# Altium schematic sheet USB.SchDoc
size A; SheetNumber: 2; SheetTotal: 2
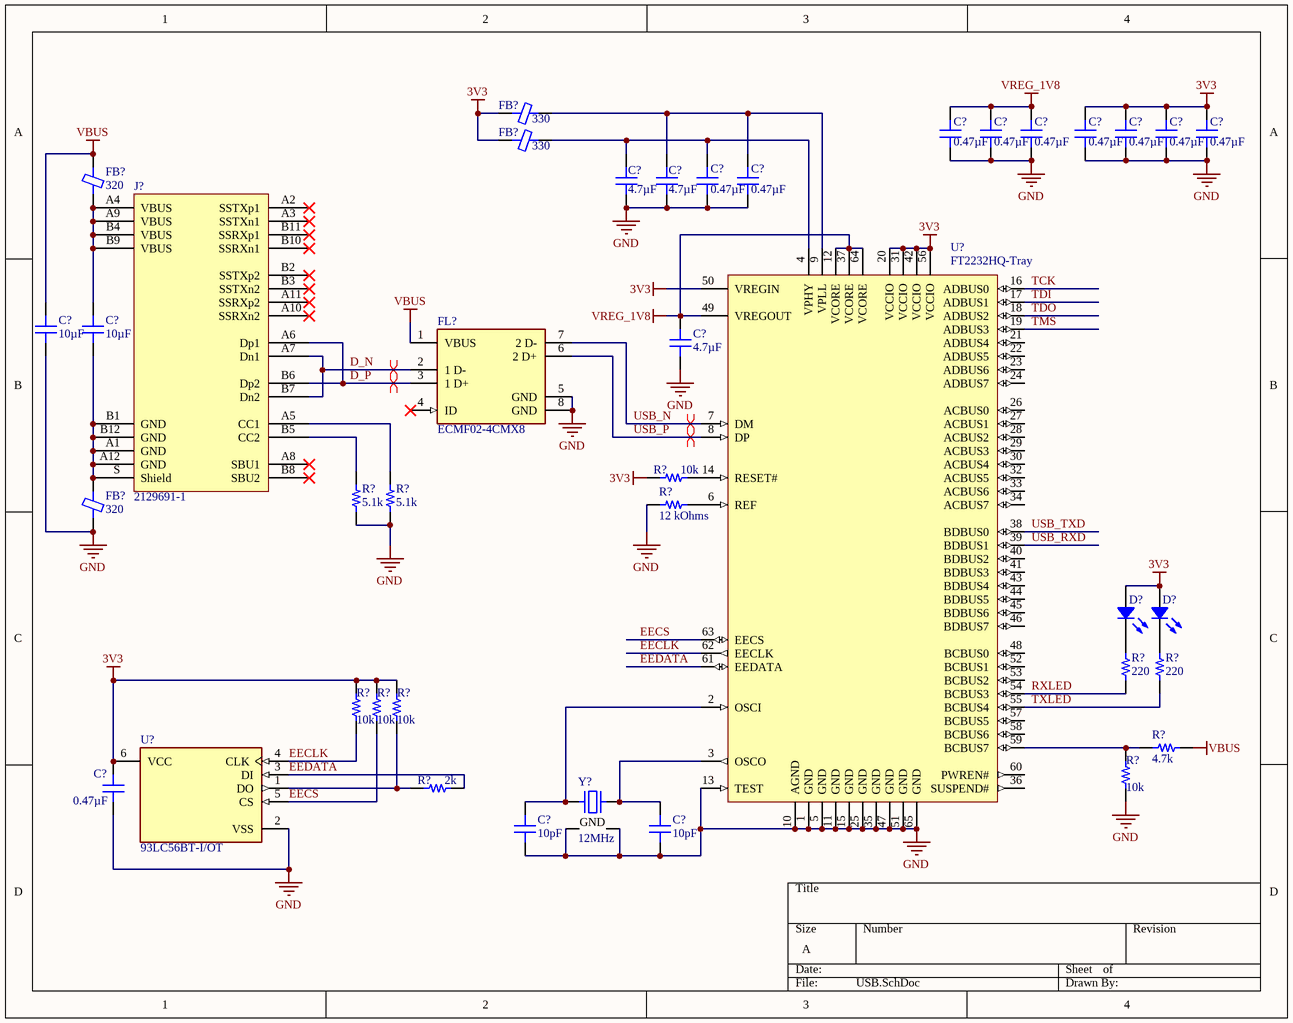
[diagram p0: USB.SchDoc]

## Parts
(Parts that share a designator on the sheet are numbered #1, #2 ... from top to bottom, then left to right.)
C?#1  0.47µF  [CAP 0603_1608]
C?#2  0.47µF  [CAP 0603_1608]
C?#3  0.47µF  [CAP 0603_1608]
C?#4  0.47µF  [CAP 0603_1608]
C?#5  0.47µF  [CAP 0603_1608]
C?#6  0.47µF  [CAP 0603_1608]
C?#7  0.47µF  [CAP 0603_1608]
C?#8  4.7µF  [CAP 0603_1608]
C?#9  4.7µF  [CAP 0603_1608]
C?#10  0.47µF  [CAP 0603_1608]
C?#11  0.47µF  [CAP 0603_1608]
C?#12  10µF  [CAP 0805_2012]
C?#13  10µF  [CAP 0805_2012]
C?#14  4.7µF  [CAP 0603_1608]
C?#15  0.47µF  [CAP 0603_1608]
C?#16  10pF  [CAP 0603_1608]
C?#17  10pF  [CAP 0603_1608]
D?#1  Yellow  [LED 0805_2012 YELLOW]  (value not drawn)
D?#2  Yellow  [LED 0805_2012 YELLOW]  (value not drawn)
FB?#1  330  [FER 0603_1608]
FB?#2  330  [FER 0603_1608]
FB?#3  320  [FER 0805_2012]
FB?#4  320  [FER 0805_2012]
FL?  ECMF02-4CMX8  [FP-Micro_QFN-8L-MFG]
J?  2129691-1  [TE USB-C 2129691-1]
R?#1  10k  [RES 0603_1608]
R?#2  5.1k  [RES 0603_1608]
R?#3  5.1k  [RES 0603_1608]
R?#4  12 kOhms  [RES 0603_1608]
R?#5  220  [RES 0603_1608]
R?#6  220  [RES 0603_1608]
R?#7  10k  [RES 0603_1608]
R?#8  10k  [RES 0603_1608]
R?#9  10k  [RES 0603_1608]
R?#10  4.7k  [RES 0603_1608]
R?#11  10k  [RES 0603_1608]
R?#12  2k  [RES 0603_1608]
U?#1  FT2232HQ-Tray  [QFN64_2_N]
U?#2  93LC56BT-I/OT  [FP-C04-028-MFG]
Y?  12MHz  [NDK NX3225SA]

## Nets
3V3: C?#4.2 C?#5.2 C?#6.2 C?#7.2 C?#15.1 D?#1.1 D?#2.1 FB?#1.1 FB?#2.1 R?#1.1 R?#7.2 R?#8.2 R?#9.2 U?#1.20(VCCIO) U?#1.31(VCCIO) U?#1.42(VCCIO) U?#1.50(VREGIN) U?#1.56(VCCIO) U?#2.6(VCC)
GND: C?#1.1 C?#2.1 C?#3.1 C?#4.1 C?#5.1 C?#6.1 C?#7.1 C?#8.1 C?#9.1 C?#10.1 C?#11.1 C?#12.1 C?#14.1 C?#15.2 C?#16.2 C?#17.2 FB?#4.1 FL?.5(GND) FL?.8(GND) R?#2.2 R?#3.2 R?#4.1 R?#11.1 U?#1.1(GND) U?#1.5(GND) U?#1.10(AGND) U?#1.11(GND) U?#1.13(TEST) U?#1.15(GND) U?#1.25(GND) U?#1.35(GND) U?#1.47(GND) U?#1.51(GND) U?#1.65(GND) U?#2.2(VSS) Y?.2(GND) Y?.4(GND)
VBUS: C?#12.2 FB?#3.2 FL?.1(VBUS) R?#10.2
VREG_1V8: C?#1.2 C?#2.2 C?#3.2 C?#14.2 U?#1.12(VCORE) U?#1.37(VCORE) U?#1.49(VREGOUT) U?#1.64(VCORE)
D_N: FL?.2(1_D-) J?.A7(Dn1) J?.B7(Dn2)
D_P: FL?.3(1_D+) J?.A6(Dp1) J?.B6(Dp2)
EECLK: R?#7.1 U?#1.62(EECLK) U?#2.4(CLK)
EECS: R?#8.1 U?#1.63(EECS) U?#2.5(CS)
EEDATA: R?#12.2 U?#1.61(EEDATA) U?#2.3(DI)
RXLED: R?#5.1 U?#1.54(BCBUS3)
TCK: U?#1.16(ADBUS0)
TDI: U?#1.17(ADBUS1)
TDO: U?#1.18(ADBUS2)
TMS: U?#1.19(ADBUS3)
TXLED: R?#6.1 U?#1.55(BCBUS4)
USB_N: FL?.7(2_D-) U?#1.7(DM)
USB_P: FL?.6(2_D+) U?#1.8(DP)
USB_RXD: U?#1.39(BDBUS1)
USB_TXD: U?#1.38(BDBUS0)
NetC?#8_2: C?#8.2 C?#10.2 FB?#2.2 U?#1.4(VPHY)
NetC?#9_2: C?#9.2 C?#11.2 FB?#1.2 U?#1.9(VPLL)
NetC?#13_1: C?#13.1 FB?#4.2 J?.A1(GND) J?.A12(GND) J?.B1(GND) J?.B12(GND) J?.S(Shield)
NetC?#13_2: C?#13.2 FB?#3.1 J?.A4(VBUS) J?.A9(VBUS) J?.B4(VBUS) J?.B9(VBUS)
NetC?#16_1: C?#16.1 U?#1.2(OSCI) Y?.1
NetC?#17_1: C?#17.1 U?#1.3(OSCO) Y?.3
NetD?#1_2: D?#1.2 R?#5.2
NetD?#2_2: D?#2.2 R?#6.2
NetJ?_A5: J?.A5(CC1) R?#3.1
NetJ?_B5: J?.B5(CC2) R?#2.1
NetR?#1_2: R?#1.2 U?#1.14(RESET#)
NetR?#4_2: R?#4.2 U?#1.6(REF)
NetR?#9_1: R?#9.1 R?#12.1 U?#2.1(DO)
NetR?#10_1: R?#10.1 R?#11.2 U?#1.59(BCBUS7)

Not connected (* = marked no-connect by the designer): FL? 4(ID)*; J? A2(SSTXp1)* A3(SSTXn1)* A8(SBU1)* A10(SSRXn2)* A11(SSRXp2)* B2(SSTXp2)* B3(SSTXn2)* B8(SBU2)* B10(SSRXn1)* B11(SSRXp1)*; U?#1 21(ADBUS4) 22(ADBUS5) 23(ADBUS6) 24(ADBUS7) 26(ACBUS0) 27(ACBUS1) 28(ACBUS2) 29(ACBUS3) 30(ACBUS4) 32(ACBUS5) 33(ACBUS6) 34(ACBUS7) 36(SUSPEND#) 40(BDBUS2) 41(BDBUS3) 43(BDBUS4) 44(BDBUS5) 45(BDBUS6) 46(BDBUS7) 48(BCBUS0) 52(BCBUS1) 53(BCBUS2) 57(BCBUS5) 58(BCBUS6) 60(PWREN#)

## Layout directives
differential pair: D_N, D_P, USB_N, USB_P

## Library data of the parts
C?#1-C?#7 C?#10 C?#11 C?#15 = GCM188R71C474KA55D: CAP CER 0.47UF 16V X7R 0603; Manufacturer: Murata Electronics; Tolerance: ±10%; Part Number: GCM188R71C474KA55D; Value: 0.47µF; Applications: Automotive; Capacitance: 0.47µF; ComponentLink1Description: Datasheet; ComponentLink1URL: https://www.murata.com/~/media/webrenewal/support/library/catalog/products/capacitor/mlcc/c03e.ashx?la=en-us; ComponentLink2Description: DigiKey Link; ComponentLink2URL: http://digikey.com/product-detail/en/murata-electronics/GCM188R71C474KA55D/490-4775-1-ND/1641694; Device Package: 0603 (1608 Metric); LastUpdated: 9/2/2020 1:03:20 AM; Lifecycle Status: Active; Minimum Order: 1; Mounting Type: Surface Mount, MLCC; Operating Temperature: -55°C ~ 125°C; Package / Case: 0603 (1608 Metric); Packaging: TapeAndReel; PartId: 11207; Part Status: Active; Price: 0.04; Ratings: AEC-Q200; Series: GCM; Size / Dimension: 0.063" L x 0.031" W (1.60mm x 0.80mm); Supplier 1: DigiKey; Supplier Part Number 1: 490-4775-1-ND; Temperature Coefficient: X7R; Thickness (Max): 0.035" (0.90mm); Voltage - Rated: 16V
C?#8 C?#9 C?#14 = C1608X7S0J475K080AC: CAP CER 4.7UF 6.3V X7S 0603; Manufacturer: TDK Corporation; Tolerance: ±10%; Part Number: C1608X7S0J475K080AC; Value: 4.7µF; Applications: General Purpose; Capacitance: 4.7µF; ComponentLink1Description: Datasheet; ComponentLink1URL: https://product.tdk.com/info/en/catalog/datasheets/mlcc_commercial_general_en.pdf?ref_disty=digikey; ComponentLink2Description: DigiKey Link; ComponentLink2URL: http://digikey.com/product-detail/en/tdk-corporation/C1608X7S0J475K080AC/445-9120-1-ND/3661604; Device Package: 0603 (1608 Metric); Features: Low ESL; LastUpdated: 9/2/2020 1:03:32 AM; Lifecycle Status: Active; Minimum Order: 1; Mounting Type: Surface Mount, MLCC; Operating Temperature: -55°C ~ 125°C; Package / Case: 0603 (1608 Metric); Packaging: TapeAndReel; PartId: 4119; Part Status: Active; Price: 0.07; Series: C; Size / Dimension: 0.063" L x 0.031" W (1.60mm x 0.80mm); Supplier 1: DigiKey; Supplier Part Number 1: 445-9120-1-ND; Temperature Coefficient: X7S; Thickness (Max): 0.035" (0.90mm); Voltage - Rated: 6.3V
C?#12 C?#13 = C2012X5R1E106K125AB: CAP CER 10UF 25V X5R 0805; Manufacturer: TDK Corporation; Tolerance: ±10%; Part Number: C2012X5R1E106K125AB; Value: 10µF; Applications: General Purpose; Capacitance: 10µF; ComponentLink1Description: Datasheet; ComponentLink1URL: https://product.tdk.com/info/en/catalog/datasheets/mlcc_commercial_general_en.pdf?ref_disty=digikey; ComponentLink2Description: DigiKey Link; ComponentLink2URL: http://digikey.com/product-detail/en/tdk-corporation/C2012X5R1E106K125AB/445-5984-1-ND/2444025; Device Package: 0805 (2012 Metric); Features: Low ESL; LastUpdated: 9/2/2020 1:04:38 AM; Lifecycle Status: Active; Minimum Order: 1; Mounting Type: Surface Mount, MLCC; Operating Temperature: -55°C ~ 85°C; Package / Case: 0805 (2012 Metric); Packaging: TapeAndReel; PartId: 4850; Part Status: Active; Price: 0.08; Series: C; Size / Dimension: 0.079" L x 0.049" W (2.00mm x 1.25mm); Supplier 1: DigiKey; Supplier Part Number 1: 445-5984-1-ND; Temperature Coefficient: X5R; Thickness (Max): 0.057" (1.45mm); Voltage - Rated: 25V
C?#16 C?#17 = 06031A100CAT2A: CAP CER 10PF 100V C0G/NP0 0603; Manufacturer: AVX Corporation; Temperature Coefficient: C0G, NP0; Tolerance: ±0.25pF; Part Number: 06031A100CAT2A; Value: 10pF; Applications: General Purpose; Capacitance: 10pF; ComponentLink1Description: Datasheet; ComponentLink1URL: http://datasheets.avx.com/C0GNP0-Dielectric.pdf; ComponentLink2Description: DigiKey Link; ComponentLink2URL: http://digikey.com/product-detail/en/avx-corporation/06031A100CAT2A/478-3668-1-ND/1116366; Device Package: 0603 (1608 Metric); LastUpdated: 9/2/2020 1:03:34 AM; Lifecycle Status: Active; Minimum Order: 1; Mounting Type: Surface Mount, MLCC; Operating Temperature: -55°C ~ 125°C; Package / Case: 0603 (1608 Metric); Packaging: TapeAndReel; PartId: 3258; Part Status: Active; Price: 0.06; Series: -; Size / Dimension: 0.063" L x 0.032" W (1.60mm x 0.81mm); Supplier 1: DigiKey; Supplier Part Number 1: 478-3668-1-ND; Thickness (Max): 0.035" (0.90mm); Voltage - Rated: 100V
D?#1 D?#2 = 5988140107F: LED YELLOW CLEAR 0805 SMD; Manufacturer: Dialight; Configuration: Standard; Current - Test: 20mA; Lens Color: Colorless; Lens Size: 1.40mm x 1.25mm; Lens Style: Rectangle with Flat Top; Millicandela Rating: 130mcd; Viewing Angle: 140°; Voltage - Forward (Vf) (Typ): 2V; Wavelength - Dominant: 593nm; Part Number: 5988140107F; Color: Yellow; ComponentLink1Description: Datasheet; ComponentLink1URL: //media.digikey.com/pdf/Data%20Sheets/Dialight%20PDFs/598_Series_0805_Pkg.pdf; ComponentLink2Description: DigiKey Link; ComponentLink2URL: http://digikey.com/product-detail/en/dialight/5988140107F/350-2041-1-ND/1291345; Device Package: 0805 (2012 Metric); Height (Max): 0.80mm; LastUpdated: 9/2/2020 1:21:22 AM; Lens Transparency: Clear; Lifecycle Status: Active; Minimum Order: 1; Mounting Type: Surface Mount; Package / Case: 0805 (2012 Metric); Packaging: TapeAndReel; PartId: 48; Part Status: Active; Price: 0.07; Series: 598; Size / Dimension: 2.00mm L x 1.25mm W; Supplier 1: DigiKey; Supplier Part Number 1: 350-2041-1-ND; Supplier Device Package: 0805; Value: Yellow
FB?#1 FB?#2 = FBMH1608HM331-TV: FERRITE BEAD 330 OHM 0603 1LN; Manufacturer: Taiyo Yuden; Current Rating (Max): 1.2A; DC Resistance (DCR) (Max): 130mOhm; Filter Type: Power Line; Impedance @ Frequency: 330 Ohms @ 100MHz; Number of Lines: 1; Part Number: FBMH1608HM331-TV; ComponentLink1Description: Datasheet; ComponentLink1URL: https://ds.yuden.co.jp/TYCOMPAS/ut/detail?pn=FBMH1608HM331-TV  &u=M; ComponentLink2Description: DigiKey Link; ComponentLink2URL: http://digikey.com/product-detail/en/taiyo-yuden/FBMH1608HM331-TV/587-3823-1-ND/4875583; Device Package: 0603 (1608 Metric); Height (Max): 0.035" (0.90mm); LastUpdated: 9/2/2020 1:18:18 AM; Lifecycle Status: Active; Minimum Order: 1; Mounting Type: Surface Mount; Operating Temperature: -40°C ~ 125°C; Package / Case: 0603 (1608 Metric); Packaging: TapeAndReel; PartId: 729; Part Status: Active; Price: 0.05; Ratings: AEC-Q200; Series: FB; Size / Dimension: 0.063" L x 0.032" W (1.60mm x 0.80mm); Supplier 1: DigiKey; Supplier Part Number 1: 587-3823-1-ND; Value: 330
FB?#3 FB?#4 = 74279220321: FERRITE BEAD 320 OHM 0805 1LN; Manufacturer: Würth Elektronik; Current Rating (Max): 2.5A; DC Resistance (DCR) (Max): 50mOhm; Impedance @ Frequency: 320 Ohms @ 100MHz; Number of Lines: 1; Part Number: 74279220321; ComponentLink1Description: Datasheet; ComponentLink1URL: https://katalog.we-online.de/pbs/datasheet/74279220321.pdf; ComponentLink2Description: DigiKey Link; ComponentLink2URL: http://digikey.com/product-detail/en/w-rth-elektronik/74279220321/732-6125-1-ND/5050861; Device Package: 0805 (2012 Metric); Height (Max): 0.043" (1.10mm); LastUpdated: 9/2/2020 1:18:21 AM; Lifecycle Status: Active; Minimum Order: 1; Mounting Type: Surface Mount; Operating Temperature: -55°C ~ 125°C; Package / Case: 0805 (2012 Metric); Packaging: TapeAndReel; PartId: 1527; Part Status: Active; Price: 0.20; Series: WE-MPSB; Size / Dimension: 0.079" L x 0.047" W (2.00mm x 1.20mm); Supplier 1: DigiKey; Supplier Part Number 1: 732-6125-1-ND; Value: 320
FL? = CMP-12075-000002-1: COMMON MODE CHOKE 2LN SMD ESD; Number of Lines: 2; DC Resistance (DCR): 4R; Package Quantity: 3000; Case/Package: QFN; Width: 0.047inch; Mount: Surface Mount; Termination: Flat; Length: 0.098inch; Height: 0.022inch; Lead Free: Lead Free; Depth: 1.25mm; REACH SVHC: No SVHC; Max Operating Temperature: 85°C; Min Operating Temperature: -30°C; Number of Pins: 8; Packaging: Tape and Reel
J? = 2129691-1: CONN RCPT USB3.1 TYPEC 24POS SMD; Manufacturer: TE Connectivity AMP Connectors; Connector Type: USB - C (Type - C); Current Rating (Amps): 0.25A, 1.25A, 5A; Gender: Receptacle; Mating Cycles: 10000; Number of Contacts: 24; Number of Ports: 1; Specifications: USB 3.1 (USB 3.1 Gen 2, Superspeed+); Voltage - Rated: 30V; Part Number: 2129691-1; ComponentLink1Description: Datasheet; ComponentLink1URL: //media.digikey.com/pdf/Data%20Sheets/Tyco%20Electonics%20AMP%20PDFs/2129691_Dwg.pdf; ComponentLink2Description: DigiKey Link; ComponentLink2URL: //digikey.com/product-detail/en/te-connectivity-amp-connectors/2129691-1/A122008TR-ND/5401336; LastUpdated: 12/9/2019 8:50:18 PM; Lifecycle Status: 0; Minimum Order: 1; Mounting Feature: Horizontal, Mid Mount; Mounting Type: Board Edge, Cutout; Surface Mount; Through Hole, Right Angle; Operating Temperature: -30°C ~ 85°C; Packaging: TapeAndReel; Part Status: Active; Price: 1.67; Series: -; Supplier 1: DigiKey; Supplier Part Number 1: A122008TR-ND; Termination: Solder
R?#1 R?#7-R?#9 R?#11 = CRCW060310K0FKTA: RES SMD 10K OHM 1% 1/10W 0603; Manufacturer: Vishay Dale; Power (Watts): 0.1W, 1/10W; Resistance: 10 kOhms; Temperature Coefficient: ±100ppm/°C; Part Number: CRCW060310K0FKTA; Value: 10k; ComponentLink1Description: Datasheet; ComponentLink1URL: http://www.vishay.com/docs/20008/dcrcw.pdf; ComponentLink2Description: DigiKey Link; ComponentLink2URL: http://digikey.com/product-detail/en/vishay-dale/CRCW060310K0FKTA/541-2980-1-ND/6073623; Composition: Thick Film; Device Package: 0603 (1608 Metric); Features: Automotive AEC-Q200; Height - Seated (Max): 0.020" (0.50mm); LastUpdated: 9/2/2020 1:10:15 AM; Lifecycle Status: Active; Minimum Order: 1; Number of Terminations: 2; Operating Temperature: -55°C ~ 155°C; Package / Case: 0603 (1608 Metric); Packaging: TapeAndReel; PartId: 9687; Part Status: Active; Price: 0.01; Ratings: AEC-Q200; Series: CRCW; Size / Dimension: 0.063" L x 0.033" W (1.60mm x 0.85mm); Supplier 1: DigiKey; Supplier Part Number 1: 541-2980-1-ND; Supplier Device Package: 0603; Tolerance: ±1%
R?#2 R?#3 = RMCF0603FT5K10: RES 5.1K OHM 1% 1/10W 0603; Manufacturer: Stackpole Electronics Inc; Power (Watts): 0.1W, 1/10W; Resistance: 5.1 kOhms; Temperature Coefficient: ±100ppm/°C; Part Number: RMCF0603FT5K10; Value: 5.1k; ComponentLink1Description: Datasheet; ComponentLink1URL: https://www.seielect.com/catalog/sei-rmcf_rmcp.pdf; ComponentLink2Description: DigiKey Link; ComponentLink2URL: http://digikey.com/product-detail/en/stackpole-electronics-inc/RMCF0603FT5K10/RMCF0603FT5K10CT-ND/1943037; Composition: Thick Film; Device Package: 0603 (1608 Metric); Features: Automotive AEC-Q200; Height - Seated (Max): 0.022" (0.55mm); LastUpdated: 9/2/2020 1:10:13 AM; Lifecycle Status: Active; Minimum Order: 1; Number of Terminations: 2; Operating Temperature: -55°C ~ 155°C; Package / Case: 0603 (1608 Metric); Packaging: CutTape; PartId: 10617; Part Status: Active; Price: 0.10; Ratings: AEC-Q200; Series: RMCF; Size / Dimension: 0.061" L x 0.031" W (1.55mm x 0.80mm); Supplier 1: DigiKey; Supplier Part Number 1: RMCF0603FT5K10CT-ND; Supplier Device Package: 0603; Tolerance: ±1%
R?#4 = CRCW060312K0FKEAHP: RES SMD 12K OHM 1% 1/4W 0603; Manufacturer: Vishay Dale; Power (Watts): 0.25W, 1/4W; Temperature Coefficient: ±100ppm/°C; Part Number: CRCW060312K0FKEAHP; Value: 12 kOhms; ComponentLink1Description: Datasheet; ComponentLink1URL: http://www.vishay.com/docs/20043/crcwhpe3.pdf; ComponentLink2Description: DigiKey Link; ComponentLink2URL: http://digikey.com/product-detail/en/vishay-dale/CRCW060312K0FKEAHP/541-12.0KSCT-ND/5326820; Composition: Thick Film; Device Package: 0603 (1608 Metric); Features: Automotive AEC-Q200, Pulse Withstanding; Height - Seated (Max): 0.022" (0.55mm); LastUpdated: 9/2/2020 1:10:12 AM; Lifecycle Status: Active; Minimum Order: 1; Number of Terminations: 2; Operating Temperature: -55°C ~ 155°C; Package / Case: 0603 (1608 Metric); Packaging: TapeAndReel; PartId: 11340; Part Status: Active; Price: 0.02; Ratings: AEC-Q200; Resistance: 12 kOhms; Series: CRCW-HP; Size / Dimension: 0.063" L x 0.033" W (1.60mm x 0.85mm); Supplier 1: DigiKey; Supplier Part Number 1: 541-12.0KSCT-ND; Supplier Device Package: 0603; Tolerance: ±1%
R?#5 R?#6 = RT0603FRE07220RL: RES SMD 220 OHM 1% 1/10W 0603; Manufacturer: Yageo; Power (Watts): 0.1W, 1/10W; Resistance: 220 Ohms; Temperature Coefficient: ±50ppm/°C; Part Number: RT0603FRE07220RL; Value: 220; ComponentLink1Description: Datasheet; ComponentLink1URL: https://www.yageo.com/upload/media/product/productsearch/datasheet/rchip/PYu-RT_1-to-0.01_RoHS_L_11.pdf; ComponentLink2Description: DigiKey Link; ComponentLink2URL: http://digikey.com/product-detail/en/yageo/RT0603FRE07220RL/YAG5947CT-ND/9370977; Composition: Thin Film; Device Package: 0603 (1608 Metric); Height - Seated (Max): 0.022" (0.55mm); LastUpdated: 9/2/2020 1:10:07 AM; Lifecycle Status: Active; Minimum Order: 1; Number of Terminations: 2; Operating Temperature: -55°C ~ 155°C; Package / Case: 0603 (1608 Metric); Packaging: TapeAndReel; PartId: 13479; Part Status: Active; Price: 0.01; Series: RT; Size / Dimension: 0.063" L x 0.031" W (1.60mm x 0.80mm); Supplier 1: DigiKey; Supplier Part Number 1: YAG5947CT-ND; Supplier Device Package: 0603; Tolerance: ±1%
R?#10 = CRCW06034K70FKTA: RES SMD 4.7K OHM 1% 1/10W 0603; Manufacturer: Vishay Dale; Power (Watts): 0.1W, 1/10W; Resistance: 4.7 kOhms; Temperature Coefficient: ±100ppm/°C; Part Number: CRCW06034K70FKTA; Value: 4.7k; ComponentLink1Description: Datasheet; ComponentLink1URL: http://www.vishay.com/docs/20008/dcrcw.pdf; ComponentLink2Description: DigiKey Link; ComponentLink2URL: http://digikey.com/product-detail/en/vishay-dale/CRCW06034K70FKTA/541-3004-1-ND/6073647; Composition: Thick Film; Device Package: 0603 (1608 Metric); Features: Automotive AEC-Q200; Height - Seated (Max): 0.020" (0.50mm); LastUpdated: 9/2/2020 1:09:40 AM; Lifecycle Status: Active; Minimum Order: 1; Number of Terminations: 2; Operating Temperature: -55°C ~ 155°C; Package / Case: 0603 (1608 Metric); Packaging: TapeAndReel; PartId: 23863; Part Status: Active; Price: 0.01; Ratings: AEC-Q200; Series: CRCW; Size / Dimension: 0.063" L x 0.033" W (1.60mm x 0.85mm); Supplier 1: DigiKey; Supplier Part Number 1: 541-3004-1-ND; Supplier Device Package: 0603; Tolerance: ±1%
R?#12 = RT0603FRE072KL: RES SMD 2K OHM 1% 1/10W 0603; Manufacturer: Yageo; Power (Watts): 0.1W, 1/10W; Resistance: 2 kOhms; Temperature Coefficient: ±50ppm/°C; Part Number: RT0603FRE072KL; Value: 2k; ComponentLink1Description: Datasheet; ComponentLink1URL: https://www.yageo.com/upload/media/product/productsearch/datasheet/rchip/PYu-RT_1-to-0.01_RoHS_L_11.pdf; ComponentLink2Description: DigiKey Link; ComponentLink2URL: http://digikey.com/product-detail/en/yageo/RT0603FRE072KL/YAG5956CT-ND/9370986; Composition: Thin Film; Device Package: 0603 (1608 Metric); Height - Seated (Max): 0.022" (0.55mm); LastUpdated: 9/2/2020 1:09:47 AM; Lifecycle Status: Active; Minimum Order: 1; Number of Terminations: 2; Operating Temperature: -55°C ~ 155°C; Package / Case: 0603 (1608 Metric); Packaging: TapeAndReel; PartId: 22292; Part Status: Active; Price: 0.01; Series: RT; Size / Dimension: 0.063" L x 0.031" W (1.60mm x 0.80mm); Supplier 1: DigiKey; Supplier Part Number 1: YAG5956CT-ND; Supplier Device Package: 0603; Tolerance: ±1%
U?#1 = CMP-0078-00003-3: Dual High Speed USB To Multipurpose UART/FIFO IC, 64-pin QFN, Tray; Manufacturer: FTDI; PackageVersion: Jun-12; ComponentLink2URL: http://www.ftdichip.com/Support/Documents/DataSheets/ICs/DS_FT2232H.pdf; ComponentLink1Description: Manufacturer URL; RevisionNote: DatasheetVersion updated to 2.21 Jun-2012; PackageReference: QFN64_2; PackageDescription: 64-Pin Quad Flat No-Lead, 9 x 9 mm Body, 0.5 mm Pitch, 4.35 x 4.35 mm Exposed Pad; ComponentLink2Description: Datasheet; ComponentLink1URL: http://www.ftdichip.com/; PartNumber: FT2232HQ-Tray; DatasheetVersion: ver 2.21, Jun-2012
U?#2 = CMP-0162-00356-2: IC EEPROM 2K SPI 2MHZ SOT23-6; Access Time: 250ns; Density: 2Kb; Max Supply Voltage: 5.5V; Interface: Serial; Min Supply Voltage: 2.5V; Nominal Supply Current: 2mA; Number of Pins: 6; Radiation Hardening: No; Length: 3.1mm; Height: 1.3mm; Min Operating Temperature: -40°C; Max Operating Temperature: 85°C; Lead Free: Lead Free; Memory Type: EEPROM; Contact Plating: Tin; REACH SVHC: No SVHC; Package Quantity: 3000; Frequency: 2MHz; Width: 1.8mm; Max Frequency: 2MHz; Case/Package: SOT-23; Mount: Surface Mount; Packaging: Tape and Reel; Memory Size: 2Kb
Y? = NX3225SA-12MHZ-STD-CSR-3: CRYSTAL 12.0000MHZ 8PF SMD; Manufacturer: NDK America, Inc.; ESR (Equivalent Series Resistance): 100 Ohms; Frequency Stability: ±15ppm; Operating Mode: Fundamental; Part Number: NX3225SA-12MHZ-STD-CSR-3; ComponentLink1Description: Datasheet; ComponentLink1URL: //media.digikey.com/pdf/Data%20Sheets/NDK%20PDFs/NX3225SA_STD-CSR-3.pdf; ComponentLink2Description: DigiKey Link; ComponentLink2URL: http://digikey.com/product-detail/en/ndk-america-inc/NX3225SA-12MHZ-STD-CSR-3/644-1179-1-ND/3125568; Frequency: 12MHz; Frequency Tolerance: ±15ppm; Height - Seated (Max): 0.024" (0.60mm); LastUpdated: 9/2/2020 1:21:59 AM; Lifecycle Status: Active; Load Capacitance: 8pF; Minimum Order: 1; Mounting Type: Surface Mount; Operating Temperature: -10°C ~ 75°C; Package / Case: 4-SMD, No Lead; Packaging: TapeAndReel; PartId: 578; Part Status: Active; Price: 0.45; Series: NX3225SA; Size / Dimension: 0.126" L x 0.098" W (3.20mm x 2.50mm); Supplier 1: DigiKey; Supplier Part Number 1: 644-1179-1-ND; Type: MHz Crystal; Value: 12MHz